# EasyEDA schematic SCH_MIW PS on PCB_2022-01-19.json

## Sheets
1 TTGO_CIRCUIT_PCB_UNIFIED: TITLE: ESP32_CIRCUIT With Power Supply and Dial; REV: 1.2; Date: 2021-5-1; Sheet: 1/1; Drawn By: Martin Nohr; Company: Nohr Photo
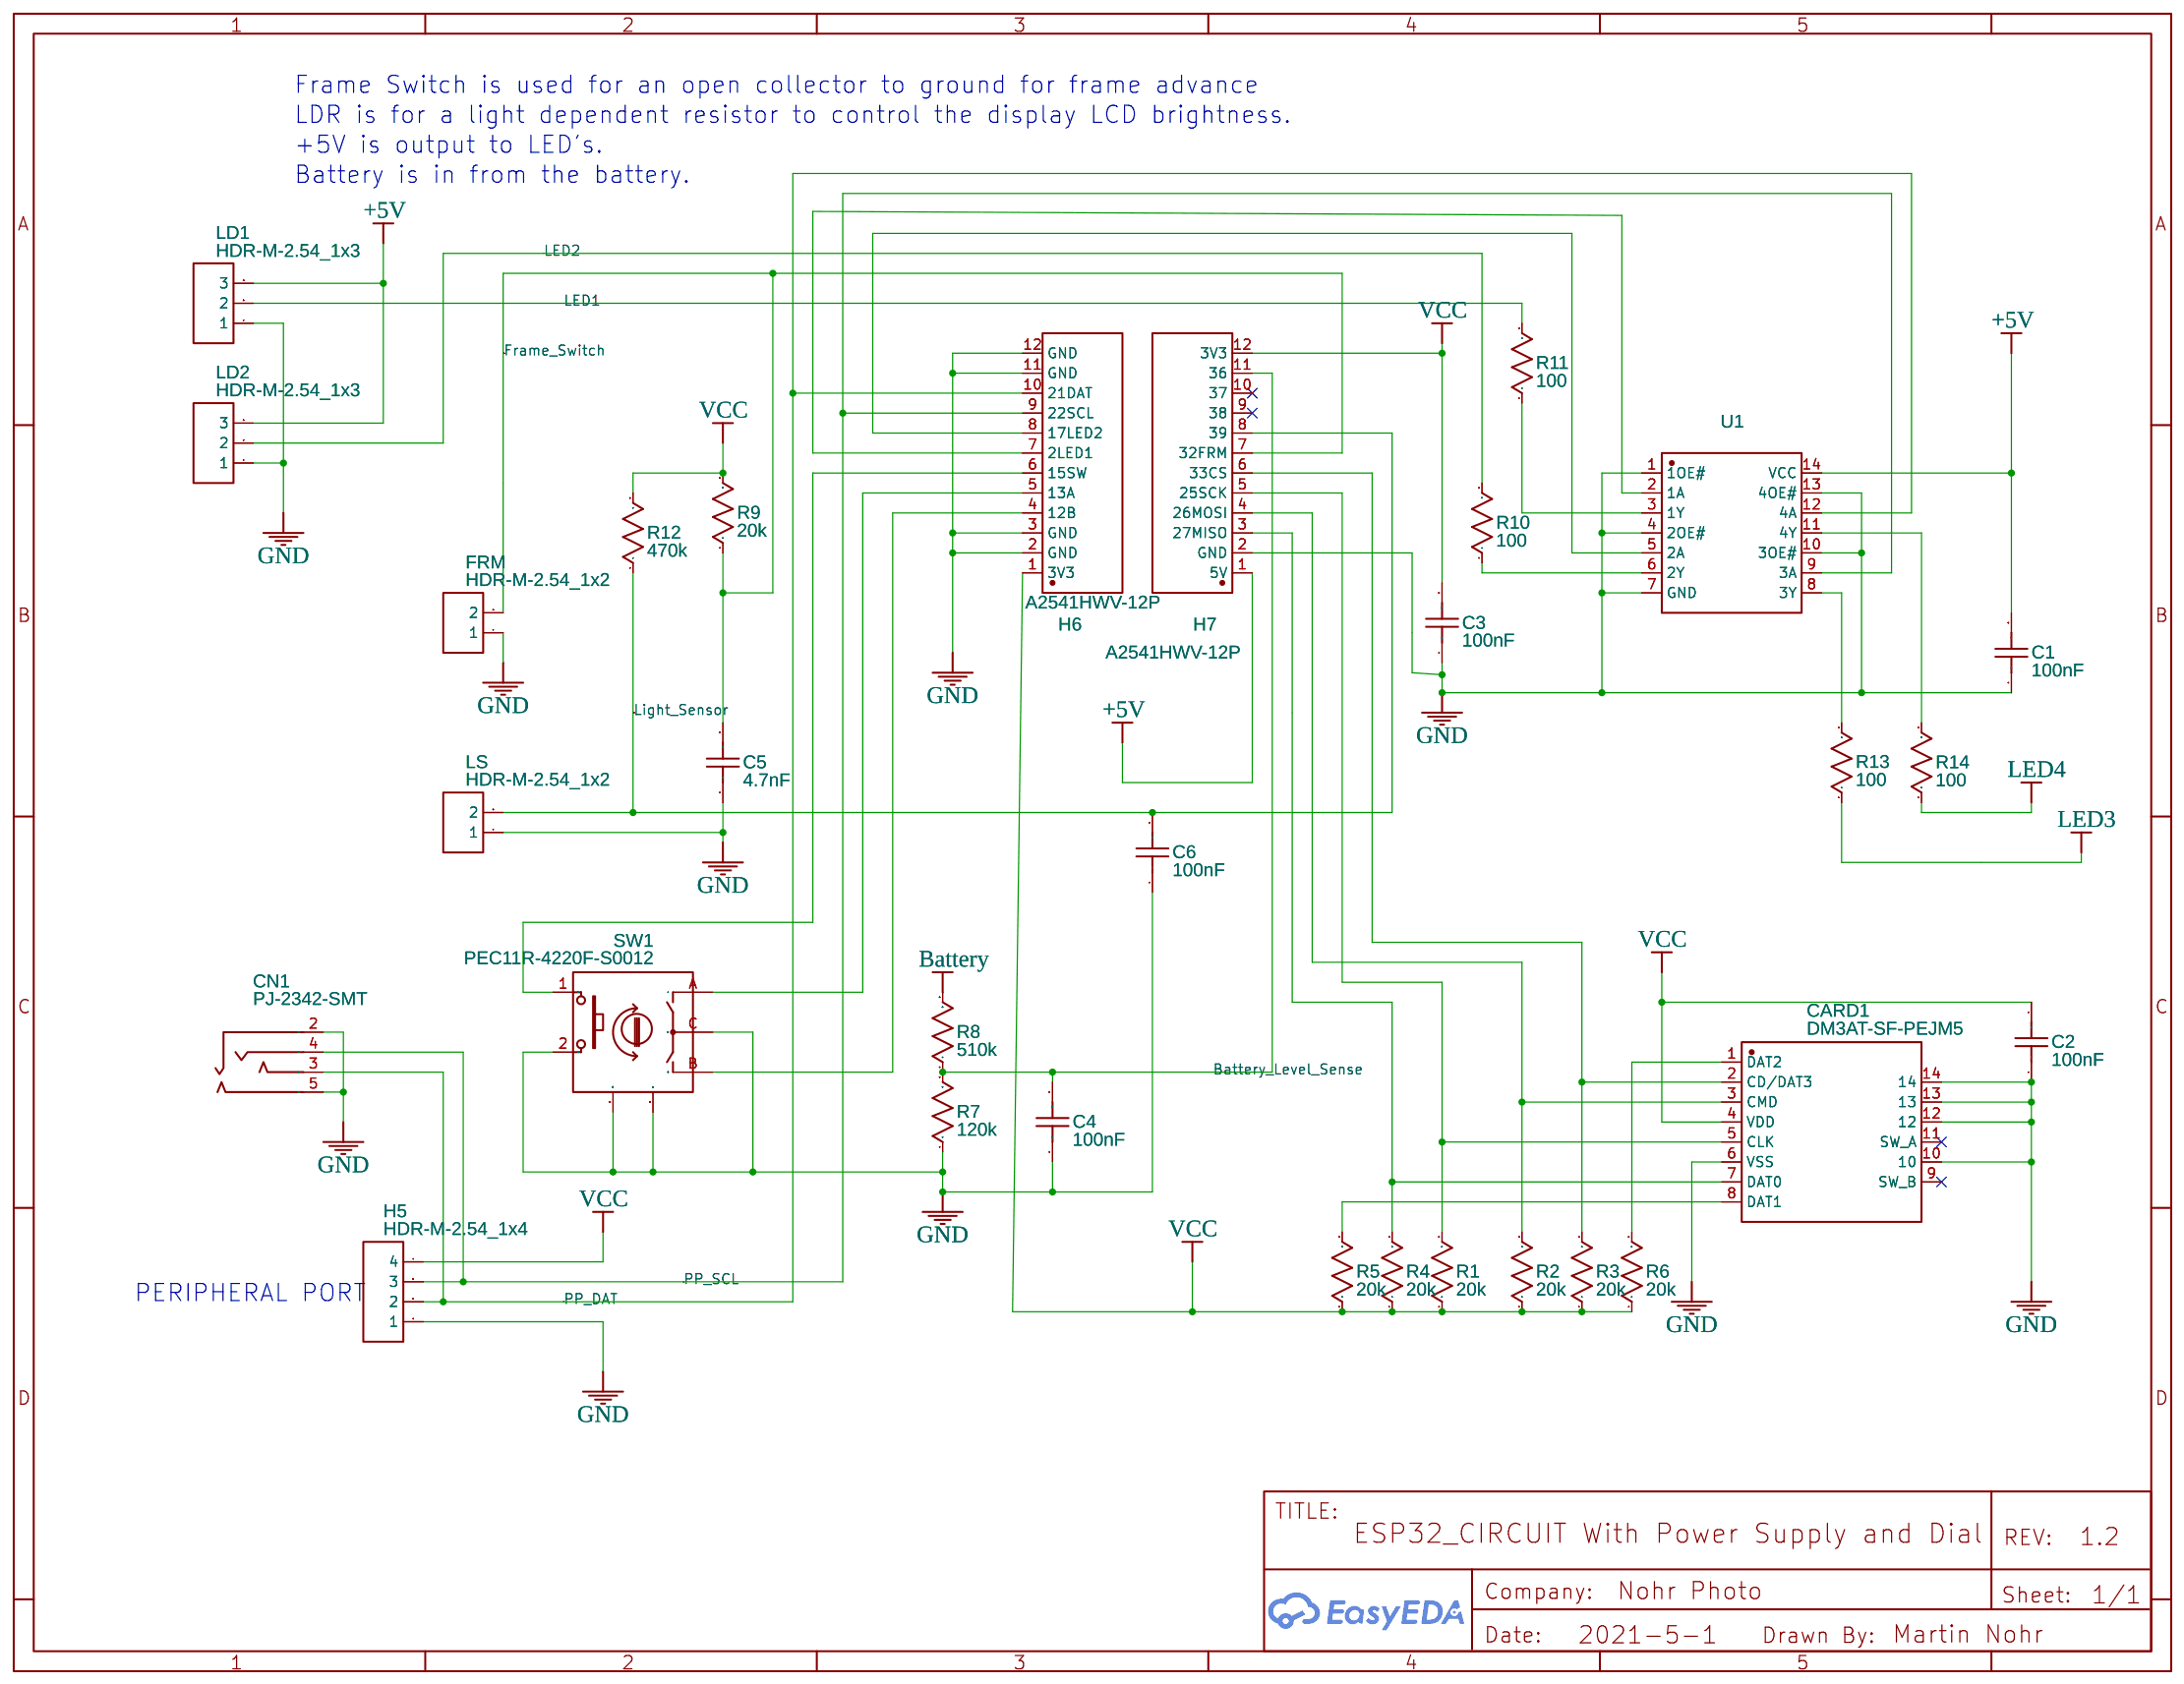
[diagram p0: TTGO_CIRCUIT_PCB_UNIFIED]
2 Power Supply Circuit: TITLE: Power Supply; REV: 1.0; Date: 2021-06-26; Drawn By: MartinNohr
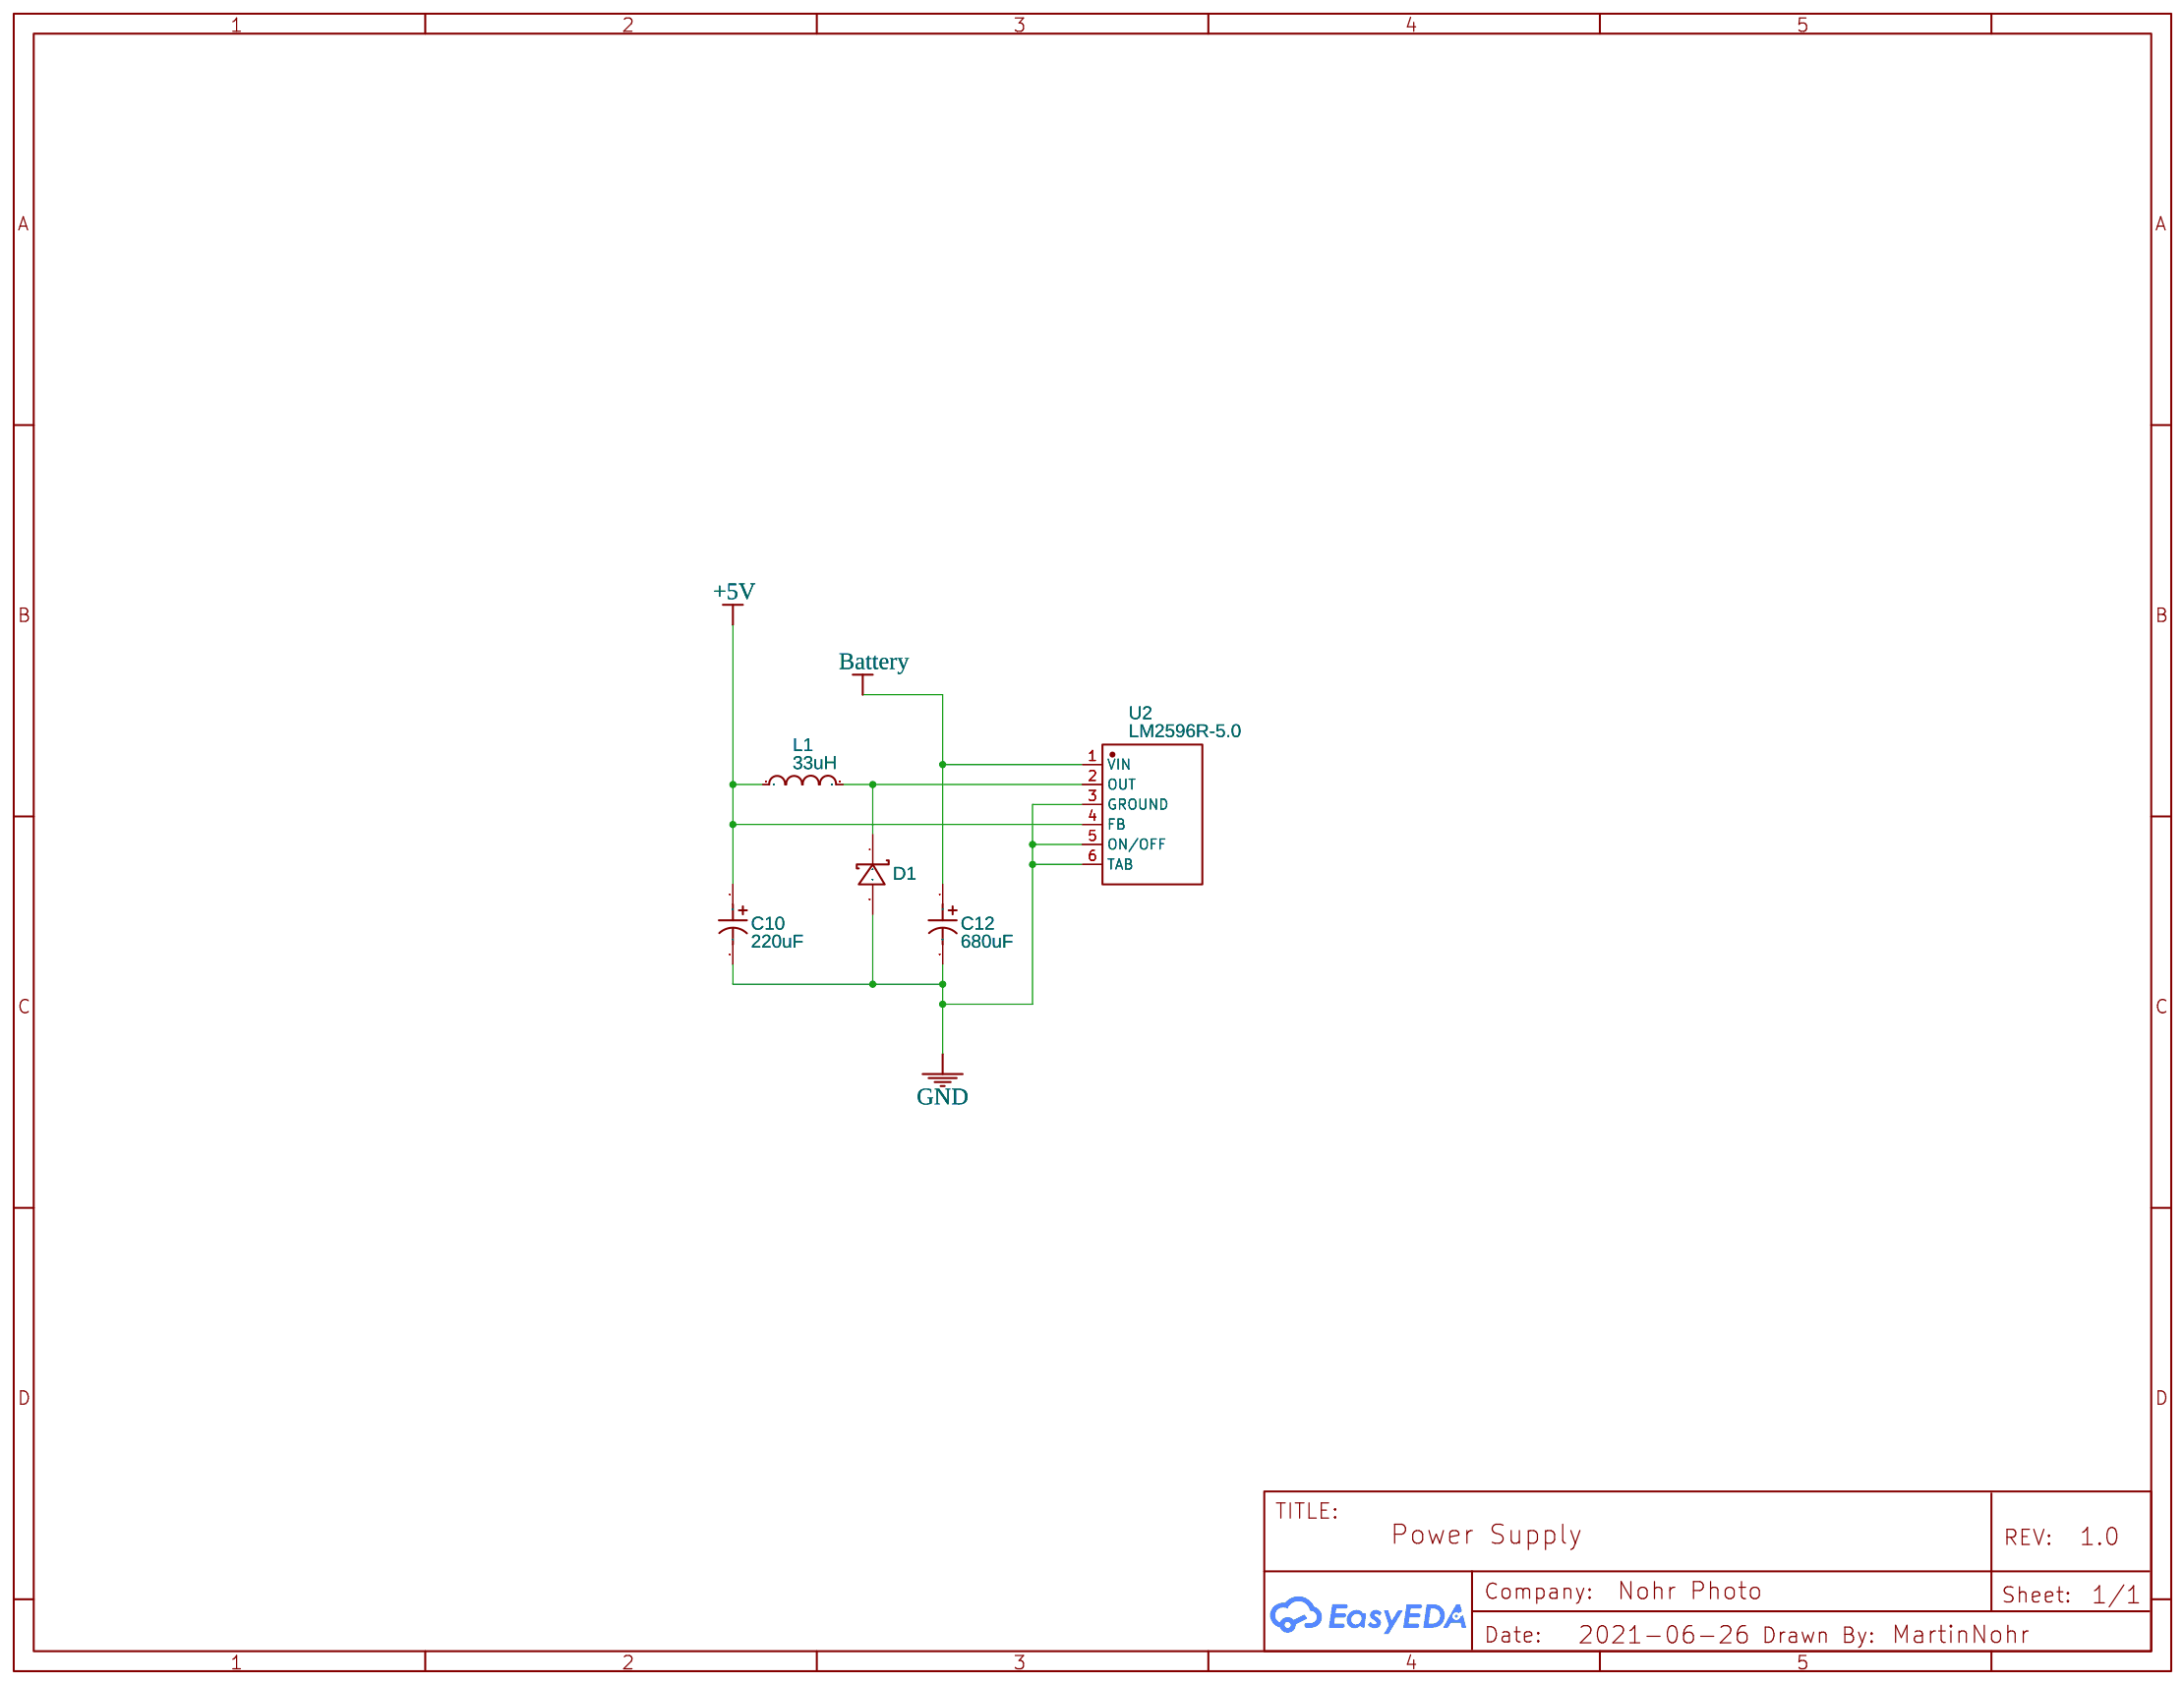
[diagram p1: Power Supply Circuit]

## Parts
sheet Power Supply Circuit
C10  220uF  [CAP-TH_BD5.0-P2.00-D0.8-FD]
C12  680uF  [CAP-TH_BD8.0-P3.50-D0.6-FD]
D1  B2100-13-F  [SMB_L4.6-W3.6-LS5.3-RD]
L1  33uH  [IND-SMD_L11.5-W10.0_SMMS1040]
U2  LM2596R-5.0  [TO-263-5_L10.2-W8.6-P1.70-LS14.4-TL]
sheet TTGO_CIRCUIT_PCB_UNIFIED
C1  100nF  [C0603]
C2  100nF  [C0603]
C3  100nF  [C0603]
C4  100nF  [C0603]
C5  4.7nF  [C0603]
C6  100nF  [C0603]
CARD1  DM3AT-SF-PEJM5  [SD-SMD_DM3AT-SF-PEJM5]
CN1  PJ-2342-SMT  [AUDIO-SMD_PJ-2342-SMT]
FRM  HDR-M-2.54_1x2  [HDR-M-2.54_1X2]
H5  HDR-M-2.54_1x4  [HDR-M-2.54_1X4]
H6  A2541HWV-12P  [HDR-TH_12P-P2.54-V_A2541HWV-12P]
H7  A2541HWV-12P  [HDR-TH_12P-P2.54-V_A2541HWV-12P]
LD1  HDR-M-2.54_1x3  [HDR-M-2.54_1X3]
LD2  HDR-M-2.54_1x3  [HDR-M-2.54_1X3]
LS  HDR-M-2.54_1x2  [HDR-M-2.54_1X2]
R1  20k  [R0603]
R2  20k  [R0603]
R3  20k  [R0603]
R4  20k  [R0603]
R5  20k  [R0603]
R6  20k  [R0603]
R7  120k  [R0603]
R8  510k  [R0603]
R9  20k  [R0603]
R10  100  [R0603]
R11  100  [R0603]
R12  470k  [R0603]
R13  100  [R0603]
R14  100  [R0603]
SW1  PEC11R-4220F-S0012  [SW-TH_PEC11R-4XXXF-SXXXX]
U1  74HCT125PW,112  [TSSOP-14_L5.0-W4.4-P0.65-LS6.4-BL]

## Library data of the parts
C10 = 160ARCP221M05X8P00: Supplier: LCSC; Supplier Part: C43340; Manufacturer: ValuePro; Manufacturer Part: KS227M016E07RR0VH2FP0; Contributor: LCSC; JLCPCB Part Class: Extended Part
C12 = SPT1EM681F12OR: Supplier: LCSC; Supplier Part: C698148; Manufacturer: Yunxing; Contributor: LCSC; JLCPCB Part Class: Extended Part
D1 = B2100-13-F: Supplier: LCSC; Manufacturer: DIODES; Contributor: LCSC; Supplier Part: C110479; JLCPCB Part Class: Extended Part
L1 = YSPI1050-330M: Supplier: LCSC; Supplier Part: C497900; Manufacturer: YJYCOIN; Contributor: LCSC
U2 = LM2596R-5.0: Supplier: LCSC; Manufacturer: HTC; Supplier Part: C77782; JLCPCB Part Class: Extended Part
C1-C4 C6 = CL10B104KB8NFNC: Supplier: LCSC; Supplier Part: C15725; Manufacturer: SAMSUNG; Manufacturer Part: CL10B104KC8NNNC; Contributor: LCSC
C5 = CL10B104KB8NFNC: Supplier: LCSC; Supplier Part: C106218; Manufacturer: YAGEO; Manufacturer Part: CC0603KRX7R9BB472; Contributor: LCSC; Package Display: No
CARD1 = DM3AT-SF-PEJM5: Supplier: LCSC; Supplier Part: C114218; Manufacturer: Hirose; Contributor: LCSC
CN1 = PJ-2342-SMT: Supplier: LCSC; Supplier Part: C397356; Manufacturer: XKB Enterprise; Contributor: LCSC; JLCPCB Part Class: Extended Part
FRM LS = HDR-M-2.54_1x2: Supplier Part: C124375; Supplier: LCSC; Contributor: LCEDA_Lib
H5 = HDR-F-2.54_1x4: Supplier Part: C124378; Supplier: LCSC; Contributor: LCEDA_Lib
H6 H7 = A2541HWV-12P: Supplier: LCSC; Supplier Part: C225509; Manufacturer: Changjiang Connectors; Contributor: LCSC; LCSC Assembly: Yes; SMT Type: Extend
LD1 LD2 = HDR-M-2.54_1x3: Supplier Part: C180248; Supplier: LCSC; Contributor: LCEDA_Lib
R1-R6 = R_0603_US: Supplier Part: C4184; Supplier: LCSC; Contributor: LCEDA_Lib; Manufacturer Part: 0603WAF2002T5E; Manufacturer: UniOhm
R7 = R_0603_US: Supplier Part: C25808; Supplier: LCSC; Contributor: LCEDA_Lib; Manufacturer Part: 0603WAF1203T5E; Manufacturer: UniOhm
R8 = R_0603_US: Supplier Part: C23192; Supplier: LCSC; Contributor: LCEDA_Lib; Manufacturer Part: 0603WAF5103T5E; Manufacturer: UniOhm
R9 = R_0603_US: Supplier Part: C4184; Supplier: LCSC; Contributor: LCEDA_Lib; Manufacturer Part: 0603WAF2002T5E; Manufacturer: UniOhm; Package Display: No
R10 R11 R13 R14 = R_0603_US: Supplier Part: C22775; Supplier: LCSC; Contributor: LCEDA_Lib; Manufacturer Part: 0603WAF1000T5E; Manufacturer: UniOhm
R12 = R_0603_US: Supplier Part: C23178; Supplier: LCSC; Contributor: LCEDA_Lib; Manufacturer Part: 0603WAF4703T5E; Manufacturer: UniOhm; Package Display: No
SW1 = PEC11R-4015F-S0024: Supplier: LCSC; Supplier Part: C143817; Manufacturer: BOURNS; Contributor: LCSC; Package Display: No
U1 = 74HCT125PW,112: Supplier: LCSC; Supplier Part: C545657; Manufacturer: Nexperia; Contributor: LCSC; JLCPCB Part Class: Extended Part; Package Display: No

## Nets
+5V: C1.2 C10.1 H7.1(5V) L1.1 LD1.3 LD2.3 U1.14(VCC) U2.4(FB)
GND: C1.1 C2.1 C3.1 C4.1 C5.1 C6.1 C10.2 C12.2 CARD1.6(VSS) CARD1.10 CARD1.12 CARD1.13 CARD1.14 CN1.2 CN1.5 D1.2 FRM.1 H5.1 H6.2(GND) H6.3(GND) H6.11(GND) H6.12(GND) H7.2(GND) LD1.1 LD2.1 LS.1 R7.1 SW1.2 SW1.C SW1.MT1 SW1.MT2 U1.1(1OE#) U1.4(2OE#) U1.7(GND) U1.10(3OE#) U1.13(4OE#) U2.3(GROUND) U2.5(ON/OFF) U2.6(TAB)
VCC: C2.2 C3.2 CARD1.4(VDD) H5.4 H6.1(3V3) H7.12(3V3) R1.1 R2.1 R3.1 R4.1 R5.1 R6.1 R9.2 R12.2
Battery: C12.1 R8.2 U2.1(VIN)
Battery_Level_Sense: C4.2 H7.11(36) R7.2 R8.1
Frame_Switch: C5.2 FRM.2 H7.7(32FRM) R9.1
LED1: LD1.2 R11.2
LED2: LD2.2 R10.2
LED3: R13.1
LED4: R14.1
Light_Sensor: C6.2 H7.8(39) LS.2 R12.1
PP_DAT: CN1.3 H5.2 H6.10(21DAT) U1.12(4A)
PP_SCL: CN1.4 H5.3 H6.9(22SCL) U1.9(3A)
Net-(CARD1-1): CARD1.1(DAT2) R6.2
Net-(CARD1-2): CARD1.2(CD/DAT3) H7.6(33CS) R3.2
Net-(CARD1-3): CARD1.3(CMD) H7.4(26MOSI) R2.2
Net-(CARD1-5): CARD1.5(CLK) H7.5(25SCK) R1.2
Net-(CARD1-7): CARD1.7(DAT0) H7.3(27MISO) R4.2
Net-(CARD1-8): CARD1.8(DAT1) R5.2
Net-(D1-1): D1.1 L1.2 U2.2(OUT)
Net-(H6-4): H6.4(12B) SW1.B
Net-(H6-5): H6.5(13A) SW1.A
Net-(H6-6): H6.6(15SW) SW1.1
Net-(H6-7): H6.7(2LED1) U1.2(1A)
Net-(H6-8): H6.8(17LED2) U1.5(2A)
Net-(R10-1): R10.1 U1.6(2Y)
Net-(R11-1): R11.1 U1.3(1Y)
Net-(R13-2): R13.2 U1.8(3Y)
Net-(R14-2): R14.2 U1.11(4Y)

Not connected (* = marked no-connect by the designer): CARD1 9(SW_B)* 11(SW_A)*; H7 9(38)* 10(37)*

## Notes on the sheets
sheet 1
- Frame Switch is used for an open collector to ground for frame advance
- LDR is for a light dependent resistor to control the display LCD brightness.
- +5V is output to LED's.
- Battery is in from the battery.
- PERIPHERAL PORT
